# Altium schematic sheet optocouplers.SchDoc
size A4
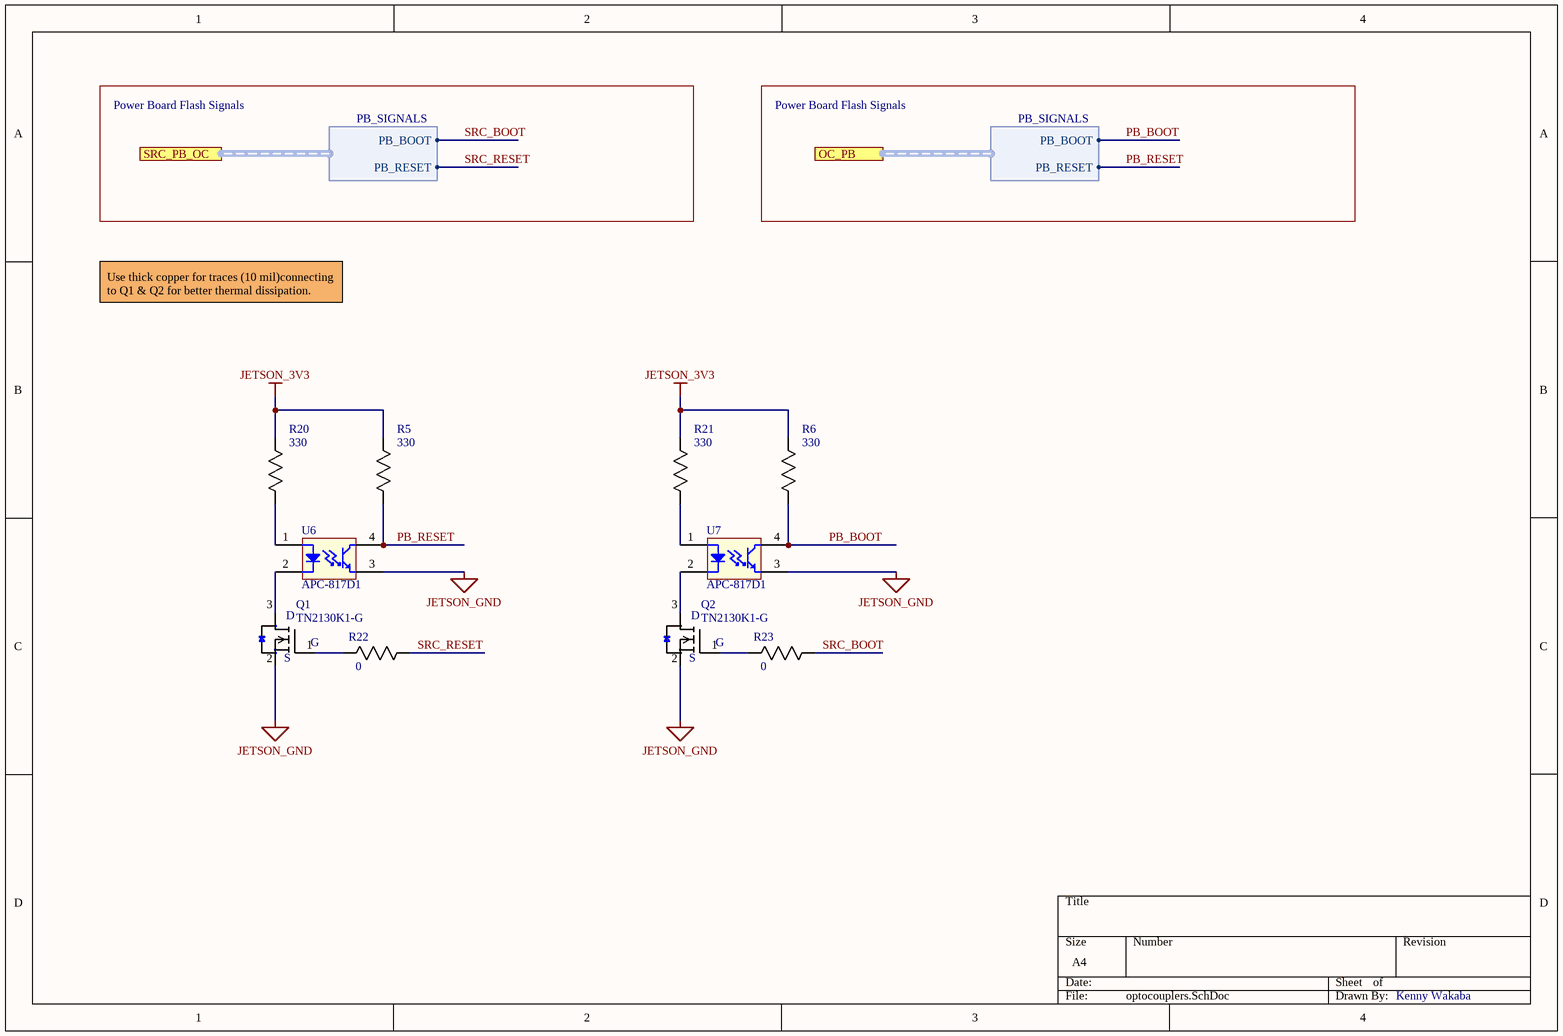
[diagram p0: optocouplers.SchDoc]

## Parts
Q1  TN2130K1-G  [SOT95P237X112-3N]
Q2  TN2130K1-G  [SOT95P237X112-3N]
R5  330  [0603]
R6  330  [0603]
R20  330  [0603]
R21  330  [0603]
R22  0  [0603]
R23  0  [0603]
U6  APC-817D1  [APC-817D1]
U7  APC-817D1  [APC-817D1]

## Ports
OC_PB (harness PB_SIGNALS), SRC_PB_OC (harness PB_SIGNALS)

## Harnesses
PB_SIGNALS: PB_BOOT, PB_RESET

## Nets
JETSON_3V3: R5.2(R2) R6.2(R2) R20.2(R2) R21.2(R2)
JETSON_GND: Q1.2(S) Q2.2(S) U6.3 U7.3
PB_BOOT: R6.1(R1) U7.4 ; port OC_PB.PB_BOOT
PB_RESET: R5.1(R1) U6.4 ; port OC_PB.PB_RESET
SRC_BOOT: R23.1(R1) ; port SRC_PB_OC.PB_BOOT
SRC_RESET: R22.1(R1) ; port SRC_PB_OC.PB_RESET
NetQ1_1: Q1.1(G) R22.2(R2)
NetQ1_3: Q1.3(D) U6.2
NetQ2_1: Q2.1(G) R23.2(R2)
NetQ2_3: Q2.3(D) U7.2
NetR20_1: R20.1(R1) U6.1
NetR21_1: R21.1(R1) U7.1

## Notes on the sheet
- Power Board Flash Signals
- Use thick copper for traces (10 mil)connecting to Q1 & Q2 for better thermal dissipation.
- Kenny Wakaba

## Library data of the parts
Q1 Q2 = MOSFET N-CH TN2130K1-G: N-Channel 300 V 85mA (Tj) 360mW (Tc) Surface Mount TO-236AB (SOT23); Mfr_Name: Microchip; Type: DEV; Copyright: Copyright (C) 2021 Ultra Librarian. All rights reserved.; Manufacturer_Part_Number: TN2130K1-G; Digi-Key_Part_Number_1: TN2130K1-GCT-ND; Digi-Key_Part_Number_2: TN2130K1-GDKR-ND; Digi-Key_Part_Number_3: TN2130K1-GTR-ND; RefDes: RefDes; Supplier 1: Digi-Key; Supplier Part Number 1: TN2130K1-GCT-ND; Part Number: MOSFET N-CH TN2130K1-G; Manufacturer Part Number 1: TN2130K1-G; Supplier URL 1: https://www.digikey.com/en/products/detail/microchip-technology/TN2130K1-G/4902939
R5 R6 R20 R21 = RES 330.0 1/8W - 5%: Default Resistor Symbol; Manufacturer Part Number 1: RMCF0603JT330R; Power (Watts): 0.125W; Tolerance: 5%; Package: 0805; Value: 330; Part Number: RES 330.0 1/8W - 5%; Supplier 1: Digi-Key; Supplier Part Number 1: RMCF0603JT330RCT-ND; Supplier URL 1: https://www.digikey.ca/en/products/detail/stackpole-electronics-inc/RMCF0603JT330R/1757998
R22 R23 = RES 0 JUMPER 0603: Default Resistor Symbol; Power (Watts): 0.125W; Package: 0805; Tolerance: N/A; Value: 0; Part Number: RES 0 JUMPER 0603
U6 U7 = APC-817D1: DIP4, DC Input, Optocoupler; Part Number: APC-817D1; Supplier 1: Digi-Key; Supplier Part Number 1: 2007-APC-817D1-SLCT-ND; Supplier URL 1: https://www.digikey.ca/en/products/detail/american-bright-optoelectronics-corporation/APC-817D1-SL/16273156